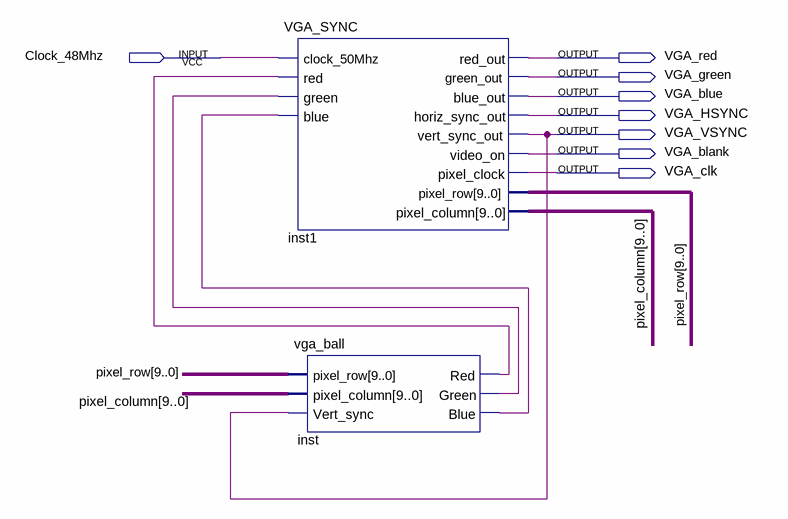
[diagram p0: schematic sheet]
// Quartus schematic ex3.bdf as structural Verilog: 2 symbols, 8 pins
module ex3 (
  input  Clock_48Mhz,
  output VGA_red,
  output VGA_green,
  output VGA_blue,
  output VGA_HSYNC,
  output VGA_VSYNC,
  output VGA_blank,
  output VGA_clk
);

  wire inst_blue, inst_green, inst_red;
  wire [9:0] pixel_column, pixel_row;

  VGA_SYNC inst1 (
    .clock_50Mhz(Clock_48Mhz), .red(inst_red), .green(inst_green), .blue(inst_blue), .red_out(VGA_red),
    .green_out(VGA_green), .blue_out(VGA_blue), .horiz_sync_out(VGA_HSYNC), .vert_sync_out(VGA_VSYNC),
    .video_on(VGA_blank), .pixel_clock(VGA_clk), .pixel_row(pixel_row), .pixel_column(pixel_column));
  vga_ball inst (
    .pixel_row(pixel_row), .pixel_column(pixel_column), .Vert_sync(VGA_VSYNC), .Red(inst_red),
    .Green(inst_green), .Blue(inst_blue));
endmodule
